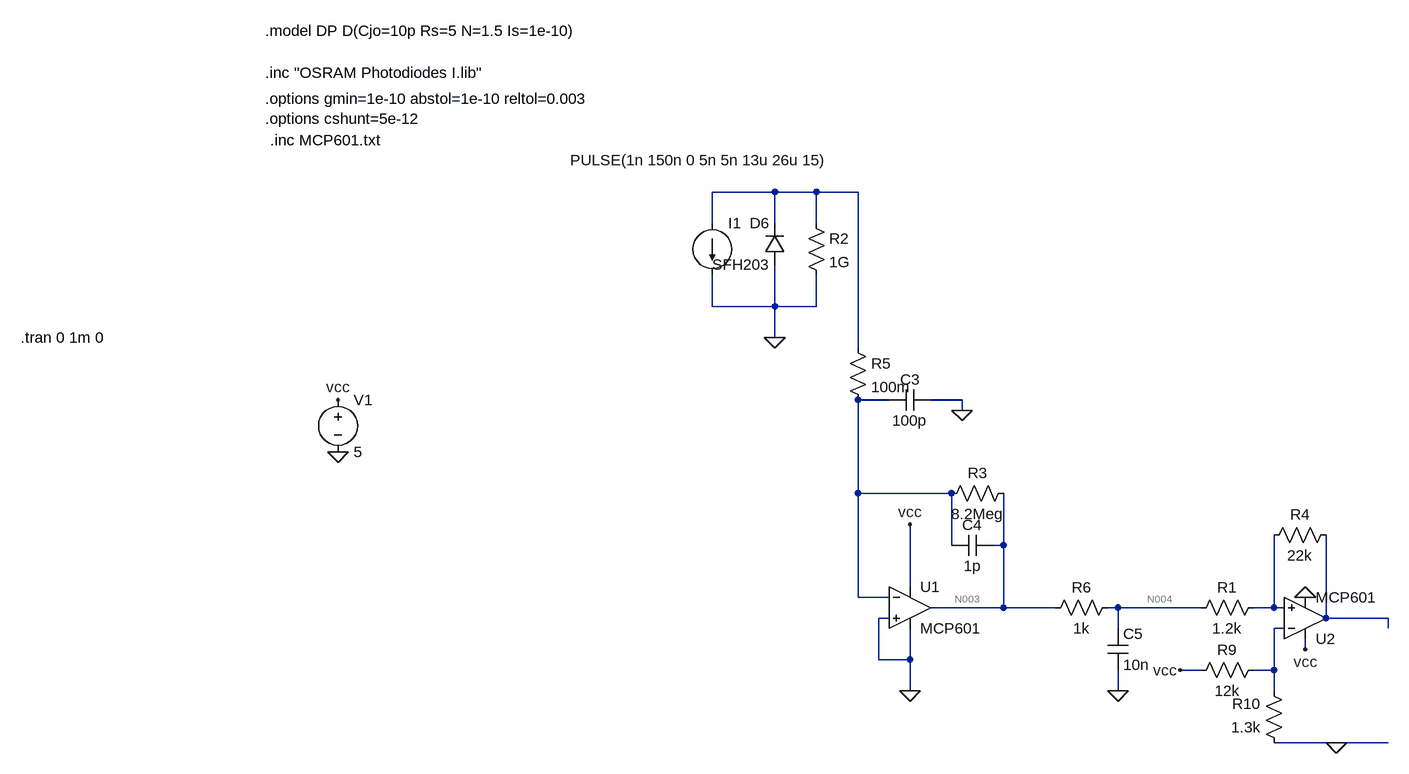
[diagram p0: schematic switch.asc]
switch.asc, the LTspice schematic file:
Version 4
SHEET 1 2192 904
WIRE 1168 -608 1072 -608
WIRE 1232 -608 1168 -608
WIRE 1296 -608 1232 -608
WIRE 1072 -560 1072 -608
WIRE 1168 -560 1168 -608
WIRE 1232 -560 1232 -608
WIRE 1072 -432 1072 -480
WIRE 1168 -432 1168 -496
WIRE 1168 -432 1072 -432
WIRE 1232 -432 1232 -480
WIRE 1232 -432 1168 -432
WIRE 1168 -384 1168 -432
WIRE 1296 -368 1296 -608
WIRE 1344 -288 1296 -288
WIRE 1456 -288 1408 -288
WIRE 1456 -272 1456 -288
WIRE 1296 -144 1296 -288
WIRE 1440 -144 1296 -144
WIRE 1440 -64 1440 -144
WIRE 1520 -64 1520 -144
WIRE 1520 -64 1504 -64
WIRE 1376 0 1376 -96
WIRE 1296 16 1296 -144
WIRE 1344 16 1296 16
WIRE 1520 32 1520 -64
WIRE 1520 32 1408 32
WIRE 1600 32 1520 32
WIRE 1696 32 1680 32
WIRE 1824 32 1696 32
WIRE 1936 32 1936 -80
WIRE 1936 32 1904 32
WIRE 1952 32 1936 32
WIRE 1344 48 1328 48
WIRE 2016 48 2016 -80
WIRE 2112 48 2016 48
WIRE 1696 64 1696 32
WIRE 1952 64 1936 64
WIRE 2112 64 2112 48
WIRE 1984 96 1984 80
WIRE 1328 112 1328 48
WIRE 1376 112 1376 64
WIRE 1376 112 1328 112
WIRE 1824 128 1792 128
WIRE 1936 128 1936 64
WIRE 1936 128 1904 128
WIRE 1376 160 1376 112
WIRE 1696 160 1696 128
WIRE 1936 160 1936 128
WIRE 2032 240 1936 240
WIRE 2112 240 2032 240
FLAG 1168 -384 0
FLAG 1376 160 0
FLAG 1456 -272 0
FLAG 1696 160 0
FLAG 1376 -96 vcc
FLAG 496 -208 0
FLAG 496 -288 vcc
FLAG 1792 128 vcc
FLAG 1984 16 0
FLAG 1984 96 vcc
FLAG 2032 240 0
SYMBOL diode 1184 -496 R180
WINDOW 0 24 64 Left 2
WINDOW 3 24 0 Left 2
SYMATTR InstName D6
SYMATTR Value SFH203
SYMBOL current 1072 -560 R0
WINDOW 3 -219 -97 Left 2
WINDOW 123 0 0 Left 0
WINDOW 39 0 0 Left 0
SYMATTR Value PULSE(1n 150n 0 5n 5n 13u 26u 15)
SYMATTR InstName I1
SYMBOL res 1216 -576 R0
SYMATTR InstName R2
SYMATTR Value 1G
SYMBOL res 1280 -384 R0
SYMATTR InstName R5
SYMATTR Value 100m
SYMBOL cap 1408 -304 R90
WINDOW 0 0 32 VBottom 2
WINDOW 3 32 32 VTop 2
SYMATTR InstName C3
SYMATTR Value 100p
SYMBOL res 1536 -160 R90
WINDOW 0 0 56 VBottom 2
WINDOW 3 32 56 VTop 2
SYMATTR InstName R3
SYMATTR Value 8.2Meg
SYMBOL cap 1504 -80 R90
WINDOW 0 0 32 VBottom 2
WINDOW 3 32 32 VTop 2
SYMATTR InstName C4
SYMATTR Value 1p
SYMBOL res 1696 16 R90
WINDOW 0 0 56 VBottom 2
WINDOW 3 32 56 VTop 2
SYMATTR InstName R6
SYMATTR Value 1k
SYMBOL cap 1680 64 R0
SYMATTR InstName C5
SYMATTR Value 10n
SYMBOL voltage 496 -304 R0
WINDOW 123 0 0 Left 0
WINDOW 39 0 0 Left 0
SYMATTR InstName V1
SYMATTR Value 5
SYMBOL res 1920 16 R90
WINDOW 0 0 56 VBottom 2
WINDOW 3 32 56 VTop 2
SYMATTR InstName R1
SYMATTR Value 1.2k
SYMBOL res 2032 -96 R90
WINDOW 0 0 56 VBottom 2
WINDOW 3 32 56 VTop 2
SYMATTR InstName R4
SYMATTR Value 22k
SYMBOL res 1920 112 R90
WINDOW 0 0 56 VBottom 2
WINDOW 3 32 56 VTop 2
SYMATTR InstName R9
SYMATTR Value 12k
SYMBOL res 1952 256 R180
WINDOW 0 36 76 Left 2
WINDOW 3 36 40 Left 2
SYMATTR InstName R10
SYMATTR Value 1.3k
SYMBOL OpAmps\\opamp2 1376 -32 R0
SYMATTR InstName U1
SYMATTR Value MCP601
SYMBOL OpAmps\\opamp2 1984 112 M180
SYMATTR InstName U2
SYMATTR Value MCP601
TEXT 8 -384 Left 2 !.tran 0 1m 0
TEXT 384 -856 Left 2 !.model DP D(Cjo=10p Rs=5 N=1.5 Is=1e-10)
TEXT 384 -792 Left 2 !.inc "OSRAM Photodiodes I.lib"
TEXT 384 -752 Left 2 !.options gmin=1e-10 abstol=1e-10 reltol=0.003\n.options cshunt=5e-12
TEXT 392 -688 Left 2 !.inc MCP601.txt

The netlist it stands for:
* switch.asc
D6 0 N001 SFH203
I1 N001 0 PULSE(1n 150n 0 5n 5n 13u 26u 15)
R2 N001 0 1G
R5 N001 N002 100m
C3 0 N002 100p
R3 N003 N002 8.2Meg
C4 N003 N002 1p
R6 N004 N003 1k
C5 N004 0 10n
V1 vcc 0 5
R1 N005 N004 1.2k
R4 N006 N005 22k
R9 N007 vcc 12k
R10 0 N007 1.3k
XU1 0 N002 vcc 0 N003 MCP601  ; pins In+ In- V+ V- OUT
XU2 N005 N007 vcc 0 N006 MCP601  ; pins In+ In- V+ V- OUT
.model D D
.lib standard.dio
.tran 0 1m 0
.model DP D(Cjo=10p Rs=5 N=1.5 Is=1e-10)
.inc "OSRAM Photodiodes I.lib"
.options gmin=1e-10 abstol=1e-10 reltol=0.003
.options cshunt=5e-12
.inc MCP601.txt
.backanno
.end

* Results of the author's LTspice run, read from the files saved beside the schematic
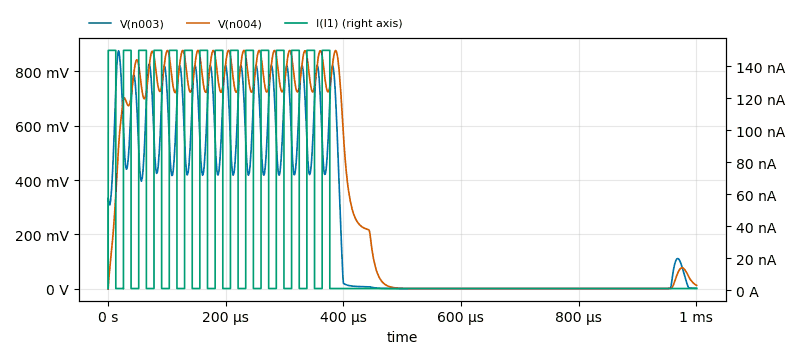
[diagram p1: Transient Analysis of switch.asc, plotted from the saved traces]
* Transient Analysis, 1 run:
*   V(n003): min 0 V, max 875.3 mV, average 246.5 mV, rms 398.4 mV, last 1.901 mV
*   V(n004): min 0 V, max 876.7 mV, average 323 mV, rms 495.3 mV, last 12.67 mV
*   I(I1): min 825 pA, max 150 nA, average 30.04 nA, rms 66.23 nA, last 1 nA